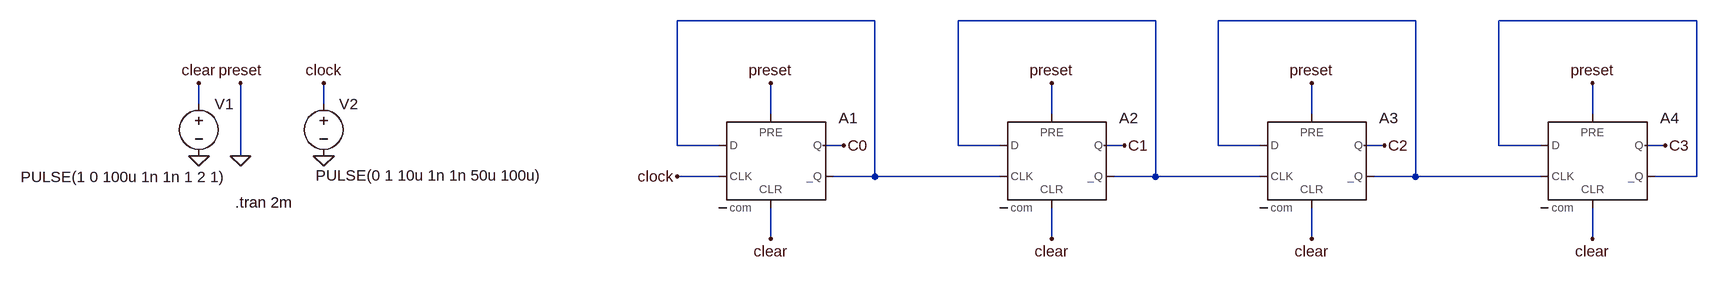
[diagram p0: schematic 1a.asc]
1a.asc, the LTspice schematic file:
Version 4
SHEET 1 1620 680
WIRE 352 -32 48 -32
WIRE 784 -32 480 -32
WIRE 1184 -32 880 -32
WIRE 1616 -32 1312 -32
WIRE -688 96 -688 64
WIRE -496 96 -496 64
WIRE 192 112 192 64
WIRE 624 112 624 64
WIRE 1024 112 1024 64
WIRE 1456 112 1456 64
WIRE 48 160 48 -32
WIRE 112 160 48 160
WIRE 304 160 272 160
WIRE 480 160 480 -32
WIRE 544 160 480 160
WIRE 736 160 704 160
WIRE 880 160 880 -32
WIRE 944 160 880 160
WIRE 1136 160 1104 160
WIRE 1312 160 1312 -32
WIRE 1376 160 1312 160
WIRE 1568 160 1536 160
WIRE -624 176 -624 64
WIRE 112 208 48 208
WIRE 352 208 352 -32
WIRE 352 208 288 208
WIRE 544 208 352 208
WIRE 784 208 784 -32
WIRE 784 208 720 208
WIRE 944 208 784 208
WIRE 1184 208 1184 -32
WIRE 1184 208 1120 208
WIRE 1376 208 1184 208
WIRE 1616 208 1616 -32
WIRE 1616 208 1552 208
WIRE 192 304 192 256
WIRE 624 304 624 256
WIRE 1024 304 1024 256
WIRE 1456 304 1456 256
FLAG 192 64 preset
FLAG 304 160 C0
FLAG 624 64 preset
FLAG 736 160 C1
FLAG 1024 64 preset
FLAG 1136 160 C2
FLAG 1456 64 preset
FLAG 1568 160 C3
FLAG 192 304 clear
FLAG 624 304 clear
FLAG 1024 304 clear
FLAG 1456 304 clear
FLAG -688 64 clear
FLAG -624 176 0
FLAG -496 176 0
FLAG -624 64 preset
FLAG -496 64 clock
FLAG 48 208 clock
FLAG -688 176 0
SYMBOL Digital\\dflop 192 112 R0
SYMATTR InstName A1
SYMATTR SpiceLine Trise=1n
SYMBOL Digital\\dflop 624 112 R0
SYMATTR InstName A2
SYMATTR SpiceLine Trise=1n
SYMBOL Digital\\dflop 1024 112 R0
SYMATTR InstName A3
SYMATTR SpiceLine Trise=1n
SYMBOL Digital\\dflop 1456 112 R0
SYMATTR InstName A4
SYMATTR SpiceLine Trise=1n
SYMBOL voltage -496 80 R0
WINDOW 123 0 0 Left 0
WINDOW 39 0 0 Left 0
WINDOW 3 -12 126 Left 2
SYMATTR Value PULSE(0 1 10u 1n 1n 50u 100u)
SYMATTR InstName V2
SYMBOL voltage -688 80 R0
WINDOW 3 -274 129 Left 2
WINDOW 123 0 0 Left 0
WINDOW 39 0 0 Left 0
SYMATTR Value PULSE(1 0 100u 1n 1n 1 2 1)
SYMATTR InstName V1
TEXT -632 248 Left 2 !.tran 2m

The netlist it stands for:
* 1a.asc
A1 N001 0 clock 0 clear N001 C0 0 DFLOP Trise=1n
A2 N002 0 N001 0 clear N002 C1 0 DFLOP Trise=1n
A3 N003 0 N002 0 clear N003 C2 0 DFLOP Trise=1n
A4 N004 0 N003 0 clear N004 C3 0 DFLOP Trise=1n
V2 clock 0 PULSE(0 1 10u 1n 1n 50u 100u)
V1 clear 0 PULSE(1 0 100u 1n 1n 1 2 1)
.tran 2m
.backanno
.end

* Results of the author's LTspice run, read from the files saved beside the schematic
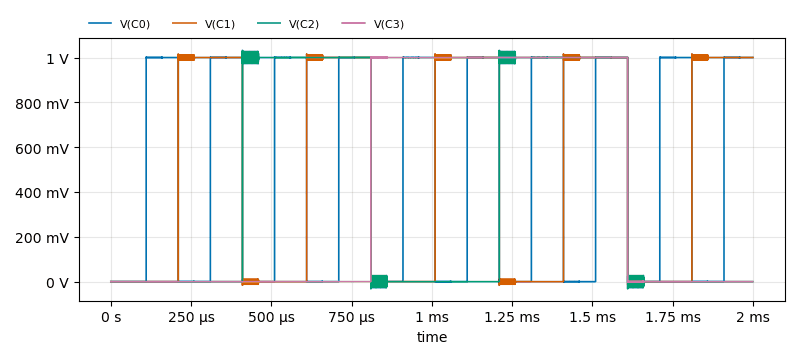
[diagram p1: Transient Analysis of 1a.asc, plotted from the saved traces]
* Transient Analysis, 1 run:
*   V(C0): min -1.737 mV, max 1.002 V, average 495 mV, rms 703.6 mV, last 1 V
*   V(C1): min -16.22 mV, max 1.016 V, average 495 mV, rms 703.6 mV, last 1 V
*   V(C2): min -31.88 mV, max 1.032 V, average 400 mV, rms 632.5 mV, last 0 V
*   V(C3): min -2.681 mV, max 1.003 V, average 400 mV, rms 632.5 mV, last 0 V